# EAGLE design Jeep_ECU (EAGLE 8.4.0)
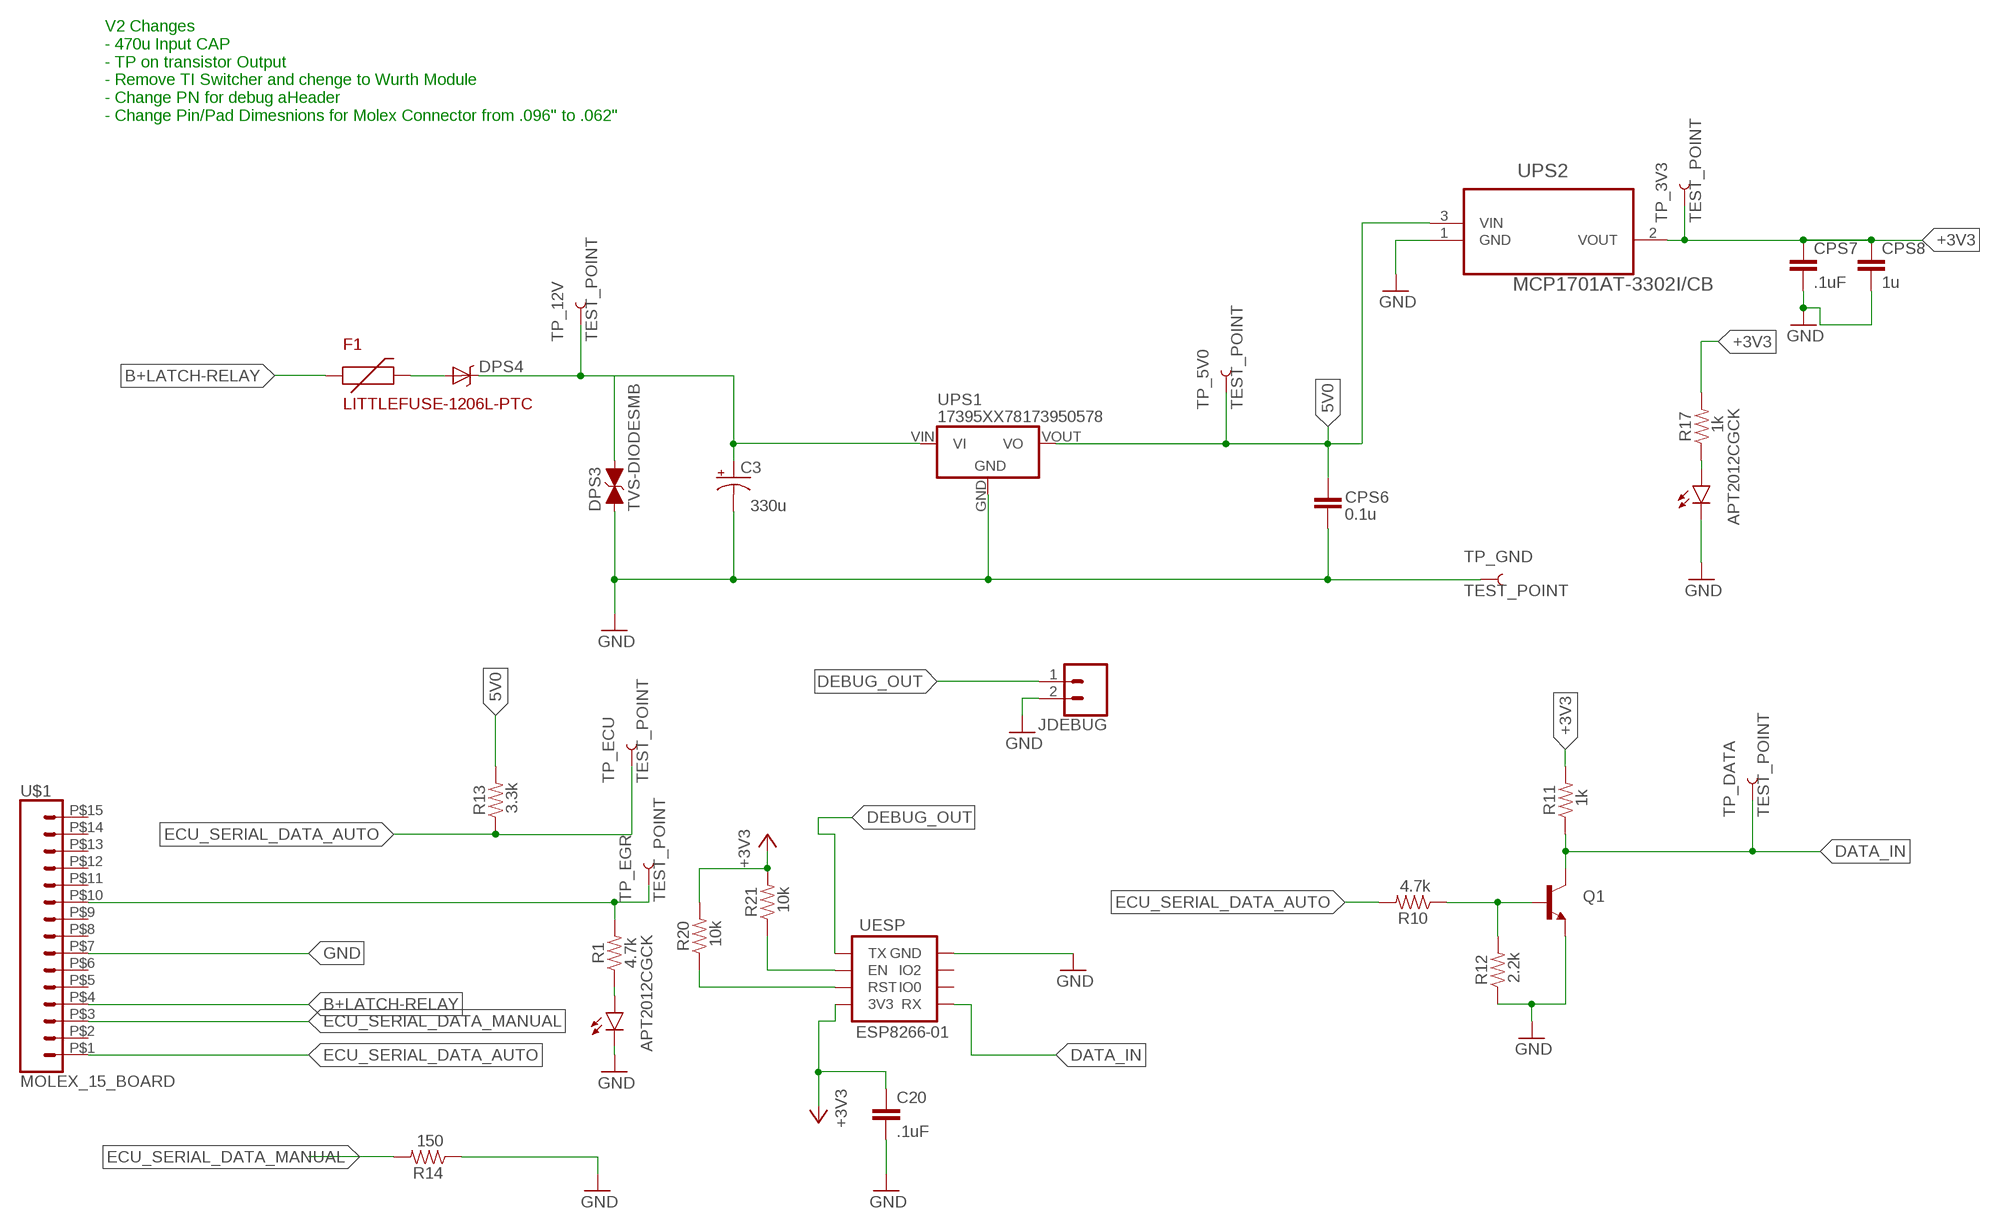
[diagram p0: schematic, sheet 1]

## Parts
C3  330u  CAP_POLTH1_JE8X10MM-SMD  [8X10MM-ELECTROLYTIC]
C20  .1uF  CAP0606-CAP  [0603-CAP]
CPS6  0.1u  CAP0606-CAP  [0603-CAP]
CPS7  .1uF  CAP0606-CAP  [0603-CAP]
CPS8  1u  CAP0606-CAP  [0603-CAP]
DPS3  TVS-DIODESMB  [SMB-DIODE]
DPS4  SCHOTTKY-DIODESSOD123SOD  [SOD-123F]
F1  LITTLEFUSE-1206L-PTC  [1206]
JDEBUG  CONN_02  [1X02]
LED_EGR  APT2012CGCK  LED0805-PKG  [0805-LED]
LED_PWR  APT2012CGCK  LED0805-PKG  [0805-LED]
Q1  NPN-TRANSISTORMMBT3904-SOT23  [SOT23]
R1  4.7k  RESISTOR0603  [0603]
R10  4.7k  RESISTOR0603  [0603]
R11  1k  RESISTOR0603  [0603]
R12  2.2k  RESISTOR0603  [0603]
R13  3.3k  RESISTOR0603  [0603]
R14  150  RESISTOR0603  [0603]
R17  1k  RESISTOR0603  [0603]
R20  10k  RESISTOR0603  [0603]
R21  10k  RESISTOR0603  [0603]
TP_3V3  TEST_POINT  [TEST_POINT]
TP_5V0  TEST_POINT  [TEST_POINT]
TP_12V  TEST_POINT  [TEST_POINT]
TP_DATA  TEST_POINT  [TEST_POINT]
TP_ECU  TEST_POINT  [TEST_POINT]
TP_EGR  TEST_POINT  [TEST_POINT]
TP_GND  TEST_POINT  [TEST_POINT]
U$1  MOLEX_15_BOARD  [MOLEX_15PIN_BOARD]
UESP  ESP8266-01  [ESP8266-01]
UPS1  17395XX78173950578  [17395XX78]
UPS2  MCP1701AT-3302I/CB  [SOT95P255X145-3N]

## Nets
5V0: CPS6.1 R13.2 TP_5V0.P$1 UPS1.VOUT(VO) UPS2.3(VIN)
+3V3: C20.1 CPS7.1 CPS8.1 R11.2 R17.2 R20.2 R21.2 TP_3V3.P$1 UESP.2(3V3) UPS2.2(VOUT)
B+LATCH-RELAY: F1.1(P$1+) U$1.P$4
DATA_IN: Q1.3(C) R11.1 TP_DATA.P$1 UESP.1(RX)
DEBUG_OUT: JDEBUG.1 UESP.8(TX)
ECU_SERIAL_DATA_AUTO: R10.2 R13.1 TP_ECU.P$1 U$1.P$1
ECU_SERIAL_DATA_MANUAL: R14.2 U$1.P$3
GND: C3.- C20.2 CPS6.2 CPS7.2 CPS8.2 DPS3.A JDEBUG.2 LED_EGR.C LED_PWR.C Q1.2(E) R12.1 R14.1 TP_GND.P$1 U$1.P$7 UESP.7(GND) UPS1.GND(GND/ADJ) UPS2.1(GND)
N$1: R1.2 TP_EGR.P$1 U$1.P$10
N$2: DPS4.A F1.2(P$2-)
N$3: R20.1 UESP.4(RST)
N$4: R21.1 UESP.6(EN)
N$5: LED_EGR.A R1.1
N$7: Q1.1(B) R10.1 R12.2
N$35: LED_PWR.A R17.1
VBR: C3.+ DPS3.C DPS4.C TP_12V.P$1 UPS1.VIN(VI)
Unconnected: U$1.P$2 U$1.P$5 U$1.P$6 U$1.P$8 U$1.P$9 U$1.P$11 U$1.P$12 U$1.P$13 U$1.P$14 U$1.P$15 UESP.3(IO0) UESP.5(IO2)

## Notes on the sheet
- V2 Changes
  - 470u Input CAP
  - TP on transistor Output
  - Remove TI Switcher and chenge to Wurth Module
  - Change PN for debug aHeader
  - Change Pin/Pad Dimesnions for Molex Connector from .096" to .062"

## Library data of the parts
C3 = Eberle:CAP_POLTH1_JE: Various electrolytic capacitors; MFG: Nichicon; PN: UCL1E331MNL1GS; VDC: 25
C20 CPS6 CPS7 = Eberle:CAP; MFG: Vishay; PN: VJ0603Y104JXJCW1BC; VDC: 16
CPS8 = Eberle:CAP; MFG: Kemet; PN: C0603C105K4RACTU; VDC: 16
DPS3 = Eberle:TVS-DIODE: TVS Diode; MFG: Littlefuse; PN: SZP6SMB43CAT3G
DPS4 = Eberle:SCHOTTKY-DIODES: SS24FL Schotkey Diode in SOD-123F package; MFG: Fairchild; PN: SS24FL
F1 = Eberle:LITTLEFUSE-1206L-PTC: LITTLEFUSE 1206L SERIES PTC; MFG: Littlefuse; PN: 1206L025YR; VAL: .25A Hold/.5A trip 16V
JDEBUG = SparkFun-Connectors:CONN_02: Multi connection point. Often used as Generic Header-pin footprint for 0.1 inch spaced/style header connections On any of the 0.1 inch spaced packages, you can populate with these: Break Away Headers - Straight <https://www.sparkfun.com/products/116> (PRT-00116) Break Away Male Headers - Right Angle <https://www.sparkfun.com/products/553> (PRT-00553) Female Headers <https://www.sparkfun.com/products/115> (PRT-00115) Break Away Headers - Machine Pin <https://www.sparkfun.com/products/117> (PRT-00117) Break Away Female Headers - Swiss Machine Pin <https://www.sparkfun.com/products/743> (PRT-00743) For SCREWTERMINALS and SPRING TERMINALS visit here: Screw Terimnals on SparkFun.com <https://www.sparkfun.com/search/results?term=Screw+Terminals> (5mm/3.5mm/2.54mm spacing) This device is also useful as a general connection point to wire up your design to another part of your project. Our various solder wires solder well into these plated through hole pads. Hook-Up Wire - Assortment (Stranded, 22 AWG) <https://www.sparkfun.com/products/11375> (PRT-11375) Hook-Up Wire - Assortment (Solid Core, 22 AWG) <https://www.sparkfun.com/products/11367> (PRT-11367) View the entire wire category on our website here <https://www.sparkfun.com/categories/141> Special notes: Molex polarized connector foot print use with: PRT-08233 with associated crimp pins and housings. 2.54_SCREWTERM for use with PRT-10571. 3.5mm Screw Terminal footprints for PRT-08084 5mm Screw Terminal footprints for use with PRT-08432; MFG: 3M; PN: 929870-01-02-RA
LED_EGR LED_PWR = Eberle:LED; MFG: Kingbright; PN: APT2012CGCK
Q1 = Eberle:NPN-TRANSISTOR; MFG: On Semiconductor; PN: MMBT3904LT1G
R1 R10 = SparkFun-Resistors:RESISTOR: Generic Resistor Package; MFG: Panasonic; PN: ERJ-3GEYJ472V
R11 R17 = SparkFun-Resistors:RESISTOR: Generic Resistor Package; MFG: Panasonic; PN: ERJ-3GEYJ102V
R12 = SparkFun-Resistors:RESISTOR: Generic Resistor Package; MFG: Panasonic; PN: ERJ-3GEYJ222V
R13 = SparkFun-Resistors:RESISTOR: Generic Resistor Package; MFG: Panasonic; PN: ERJ-3GEYJ332V
R14 = SparkFun-Resistors:RESISTOR: Generic Resistor Package; MFG: Panasonic; PN: ERJ-3GEYJ151V
R20 R21 = SparkFun-Resistors:RESISTOR: Generic Resistor Package; MFG: Panasonic; PN: ERJ-3GEYJ103V
TP_3V3 TP_5V0 TP_12V TP_DATA TP_ECU TP_EGR TP_GND = Eberle:TEST_POINT: Test Point; MFG: Harwin; PN: S1751-46
U$1 = Eberle:MOLEX_15_BOARD: PCB Board Layout that Accepts .063" Molex Male Tail Pins PN 02-09-2134 . Tale is .063" and pin is .096"; MFG: Molex; PN: 03-09-2151 / 02-09-2134
UESP = Eberle:ESP8266-01: ESP8266-01 WiFi Module; MFG: 3M; PN: 929852-01-04-RB
UPS1 = Eberle:17395XX78: Wurth Electronics Power Modules: 17395xx78 Offer 5V and 3.3V All in one switching regulator up to 0.5A; MFG: Wurth; PN: 173950578
UPS2 = Microchip_By_element14_Batch_1:MCP1701AT-3302I/CB: IC, LDO REG, 250MA, 3.3V; MFG: Microchip; MPN: MCP1701AT-3302I/CB; OC_FARNELL: 1605554; OC_NEWARK: 11N7985; PACKAGE: SOT-23; PN: MCP1701AT-3302I/CB; SUPPLIER: MICROCHIP

## Net classes
0 default: width 0.33 mm

## Board
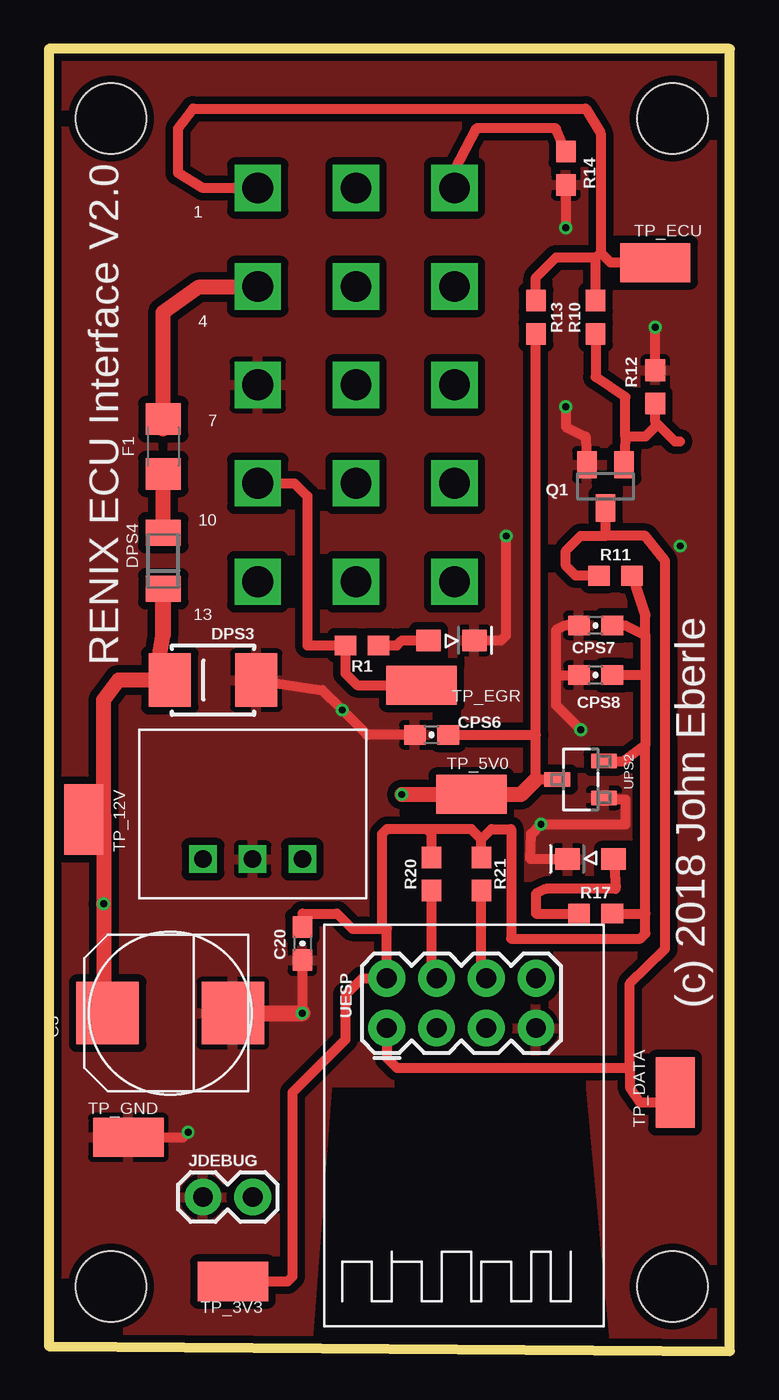
[diagram p1: board, top side]
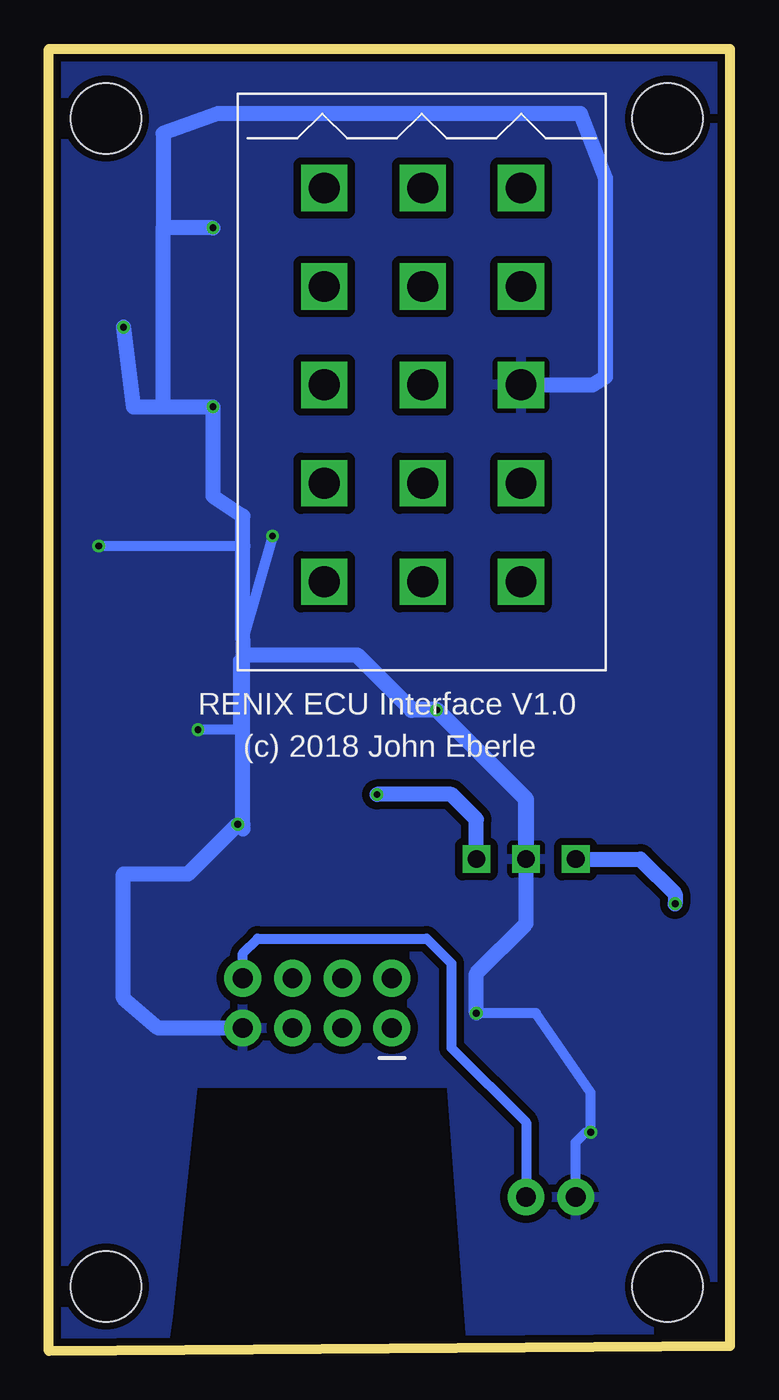
[diagram p2: board, bottom side, seen from below]

Size 34.8 x 66.55 mm. Coordinates in mm from the lower left corner, seen from the top.
Outline: 0,66.55 0,0.25 34.8,0 34.8,66.55 0,66.55
Copper layers (1*16): Top 0.035mm / dielectric 1.5mm / Bottom 0.035mm
Design rules "SeeedStudio_2layer_DRU_no_angle_20140221": minimum track width 6mil, minimum drill 12mil, track to track 6mil, track to pad 6mil, pad to pad 6mil, via to via 6mil, smd to smd 0mil, copper to edge 10mil, drill to drill 10mil, minimum pad ring 10mil, minimum via ring 6mil, stop-mask expansion 2mil, vias tented up to drill 100mil, thermal gap 10mil
Holes 3.6 mm at 3.17,3.3 31.88,3.3 3.17,62.99 31.88,62.99

### Footprints (pad centres in the part's own frame; a part is rotated, then mirrored left to right if it is on the bottom)
8X10MM-ELECTROLYTIC = smd 3.2 x 3.2: + 0,6.4; - 0,0
0603-CAP = smd 1.1 x 1: 1 -0.85,0; 2 0.85,0
SMB-DIODE = smd 2.159 x 2.743: A -2.211,0; C 2.211,0
SOD-123F = smd 1.34 x 1.8: A 1.43,0; C -1.43,0
1206 = smd 1.6 x 1.8: 1 -1.4,0; 2 1.4,0
1X02 = drill 1.016 pad 1.88: 1 0,0; 2 2.54,0
0805-LED = smd 1.25 x 1.1: A 1.175,0; C -1.175,0
SOT23 = smd 1 x 1.4: 1 -0.95,-1.1; 2 0.95,-1.1; 3 0,1.1
0603 = smd 1.1 x 1: 1 -0.85,0; 2 0.85,0
TEST_POINT = smd 2 x 3.6: P$1 0,0
MOLEX_15PIN_BOARD = drill 1.575 square: P$1 -5.08,10.16; P$2 -0.051,10.16; P$3 4.978,10.16; P$4 -5.08,5.131; P$5 -0.051,5.131; P$6 4.978,5.131; P$7 -5.08,0.102; P$8 -0.051,0.102; P$9 4.978,0.102; P$10 -5.08,-4.928; P$11 -0.051,-4.928; P$12 4.978,-4.928; P$13 -5.08,-9.957; P$14 -0.051,-9.957; P$15 4.978,-9.957
ESP8266-01 = drill 1.016 pad 1.88: 1 -3.81,-1.27; 2 -3.81,1.27; 3 -1.27,-1.27; 4 -1.27,1.27; 5 1.27,-1.27; 6 1.27,1.27; 7 3.81,-1.27; 8 3.81,1.27
17395XX78 = drill 0.9 square: GND 0,0; VIN -2.54,0; VOUT 2.54,0
SOT95P255X145-3N = smd 0.75 x 1.321: 1 -0.94,-1.194; 2 0.94,-1.194; 3 0,1.194

### Placement (x,y rotation side)
C3  9.4,17.27 90 top
C20  12.95,20.83 270 top
CPS6  19.56,31.5 180 top
CPS7  27.94,37.08 180 top
CPS8  27.94,34.54 180 top
DPS3  8.38,34.29 180 top
DPS4  5.84,40.39 90 top
F1  5.84,46.23 270 top
JDEBUG  10.41,7.87 180 top
LED_EGR  20.57,36.32 180 top
LED_PWR  27.69,25.15 0 top
Q1  28.45,44.2 180 top
R1  16,36.07 180 top
R10  27.94,52.83 90 top
R11  28.96,39.62 0 top
R12  30.99,49.28 270 top
R13  24.89,52.83 270 top
R14  26.42,60.45 90 top
R17  27.94,22.35 0 top
R20  19.56,24.38 90 top
R21  22.1,24.38 90 top
TP_3V3  9.4,3.56 90 top
TP_5V0  21.59,28.45 90 top
TP_12V  1.78,27.18 0 top
TP_DATA  32,13.21 0 top
TP_ECU  30.99,55.63 270 top
TP_EGR  19.05,34.04 90 top
TP_GND  4.06,10.92 90 top
U$1  15.75,49.28 0 top
UESP  21.08,17.78 0 top
UPS1  10.41,25.15 0 top
UPS2  27.18,29.21 90 top

### Tracks (layer width: path | path; a pad name or v marks a point on that pad's centre or on a via)
5V0  (via drill 0.35)
  Top 0.508: 24.89,31.5 24.89,29.21 UPS2.3 | 24.89,31.5 R13.2 | CPS6.1 24.89,31.5
  Top 0.762: v18.03,28.45 TP_5V0.P$1 24.13,28.45 24.89,29.21
  Bottom 0.762: UPS1.VOUT 12.95,27.18 14.22,28.45 v18.03,28.45
+3V3
  Top 0.508: 30.48,34.54 CPS8.1 | 30.48,34.54 30.48,30.99 | 30.48,30.99 29.46,30.23 29.39,30.15 UPS2.2 | CPS7.1 29.46,37.08 30.48,36.58 | R11.2 30.48,37.59 30.48,36.58 | 30.48,36.58 30.48,34.54 | 30.48,22.35 30.48,30.99 | C20.1 12.95,22.35 14.73,22.35 15.49,21.59 17.02,21.59 | 17.02,21.59 17.27,21.59 UESP.2 16,19.05 15.16,18.21 15.16,15.93 12.45,13.21 12.45,3.81 12.19,3.56 TP_3V3.P$1 | R20.2 19.56,26.42 19.3,26.67 | 19.3,26.67 17.27,26.67 17.02,26.42 17.02,21.59 | R21.2 22.1,26.16 | 22.1,26.16 21.59,26.67 19.3,26.67 | 22.1,26.16 22.61,26.67 23.62,26.67 23.62,21.08 30.23,21.08 30.48,21.34 30.48,22.35 | R17.2 30.48,22.35
B+LATCH-RELAY
  Top 0.508: U$1.P$4 10.62,54.36
  Top 0.762: 10.62,54.36 7.62,54.36 5.84,53.09 F1.1 5.84,47.12
DATA_IN
  Top 0.508: 28.45,41.66 Q1.3 | 28.45,41.66 30.48,41.66 31.5,40.39 31.5,20.55 29.7,18.8 29.7,14.48 | 28.45,41.66 27.18,41.66 26.42,40.89 26.42,40.13 26.92,39.62 R11.1 | TP_DATA.P$1 32,12.7 30.23,12.7 29.7,13.48 29.7,14.48 | UESP.1 17.27,14.99 17.78,14.48 29.7,14.48
DEBUG_OUT
  Bottom 0.508: UESP.8 24.89,20.32 24.13,21.08 15.49,21.08 14.22,19.81 14.22,15.49 10.41,11.68 JDEBUG.1
ECU_SERIAL_DATA_AUTO
  Top 0.508: U$1.P$1 7.87,59.44 6.6,60.2 6.6,62.48 7.37,63.5 27.43,63.5 28.19,62.23 28.19,56.13 | R13.1 24.89,54.86 25.91,55.88 27.94,55.88 | R10.2 27.94,55.88 | 28.19,56.13 27.94,55.88 | TP_ECU.P$1 28.7,55.63 28.19,56.13
ECU_SERIAL_DATA_MANUAL
  Top 0.508: U$1.P$3 20.73,60.35 21.84,62.48 25.91,62.48 R14.2
GND  (via drill 0.35)
  Top 0.508: R14.1 v26.42,57.4 | v26.42,48.26 26.42,47.24 27.43,46.74 Q1.2 | R12.1 v30.99,52.32 | 25.91,34.54 25.91,33.02 v27.18,31.75 | 25.91,34.54 CPS8.2 | UPS2.1 28.45,28.19 29.46,28.19 29.46,26.92 v25.15,26.92 24.64,26.42 24.6,25.15 LED_PWR.C | DPS3.A 13.97,33.78 v14.99,32.77 16.26,31.5 CPS6.2 | CPS7.2 26.42,37.08 25.91,36.83 25.91,34.54 | C20.2 v12.95,17.27 | TP_GND.P$1 6.86,10.92 v7.11,11.18 | v23.37,41.66 23.37,36.58 23.11,36.32 LED_EGR.C
  Top 0.813: C3.- v12.95,17.27
  Bottom 0.508: v25.15,26.92 24.89,26.92 | v32.26,41.15 24.89,41.15 | 24.89,35.56 25.15,35.31 25.15,31.75 v27.18,31.75 | v12.95,17.27 9.91,17.27 7.11,13.21 v7.11,11.18 7.37,11.18 7.87,10.67 JDEBUG.2 | v23.37,41.66 24.89,36.32
  Bottom 0.762: U$1.P$7 7.01,49.38 6.35,49.78 6.35,59.94 7.62,63.25 26.16,63.25 28.96,62.23 28.96,57.4 | v26.42,57.4 28.96,57.4 | 19.05,35.56 24.89,35.56 | 24.89,35.56 24.89,36.32 24.89,41.15 24.89,42.67 26.42,43.69 v26.42,48.26 28.96,48.26 | UESP.7 29.21,16.51 30.99,18.03 30.99,24.38 27.69,24.38 v25.15,26.92 | 28.96,48.26 28.96,57.4 | 24.89,26.67 24.89,26.92 24.89,35.56 | v30.99,52.32 30.48,48.26 28.96,48.26 | v12.95,17.27 12.95,19.3 10.41,21.84 UPS1.GND
  Bottom 0.813: 19.05,35.56 16.26,32.77 v14.99,32.77 10.41,28.19 UPS1.GND
  pour Bottom (isolate 0.381): 0,0 0,66.55 34.8,66.55 34.8,0 28.96,0 28.7,1.78 27.43,13.72 14.22,13.72 13.21,0.25
  pour Top (isolate 0.381): 0,66.55 34.8,66.55 34.8,0 28.96,0 27.69,13.72 14.22,13.72 13.21,0.25 0,0.25
N$1
  Top 0.508: U$1.P$10 12.55,44.35 13.21,43.69 13.21,36.07 R1.2 15.15,34.63 15.75,34.04 TP_EGR.P$1
N$2
  Top 0.762: DPS4.A F1.2
N$3
  Top 0.508: UESP.4 19.56,19.3 R20.1
N$4
  Top 0.508: UESP.6 22.1,19.3 R21.1
N$5
  Top 0.508: R1.1 17.78,36.07 18.03,36.32 LED_EGR.A
N$7
  Top 0.508: R10.1 27.94,49.78 29.46,48.77 29.46,46.74 | 29.46,46.74 Q1.1 | 30.99,47.5 R12.2 | 30.99,47.5 30.99,47.24 30.48,46.74 29.46,46.74 | 32.26,46.48 32,46.48 30.99,47.5
N$35
  Top 0.508: LED_PWR.A 28.96,23.62 25.4,23.62 24.89,23.37 24.89,22.35 R17.1
VBR  (via drill 0.35)
  Top 0.762: 2.79,27.43 2.79,33.27 3.56,34.29 DPS3.C 5.66,35.56 5.84,36.65 | 2.79,27.43 v2.79,22.86 2.79,17.68 3,17.22 | TP_12V.P$1 2.29,26.92 2.79,27.43
  Top 0.813: 6.35,33.71 DPS3.C | 5.84,36.65 DPS4.C | 3,17.22 C3.+
  Bottom 0.762: UPS1.VIN 4.57,25.15 2.79,23.37 v2.79,22.86

### Text on the board
tPlace: RENIX ECU Interface V2.0 | (c) 2018 John Eberle
bPlace: RENIX ECU Interface V1.0 | (c) 2018 John Eberle
tNames: 1 | 4 | 7 | 10 | 13